# Altium project 2024001 A Soutra Plainsong Metronome.PrjPcb (part 3 of 3)

## Sheet IOa.SchDoc: Plainsong Metronome
size A4; SheetNumber: 8; SheetTotal: 9
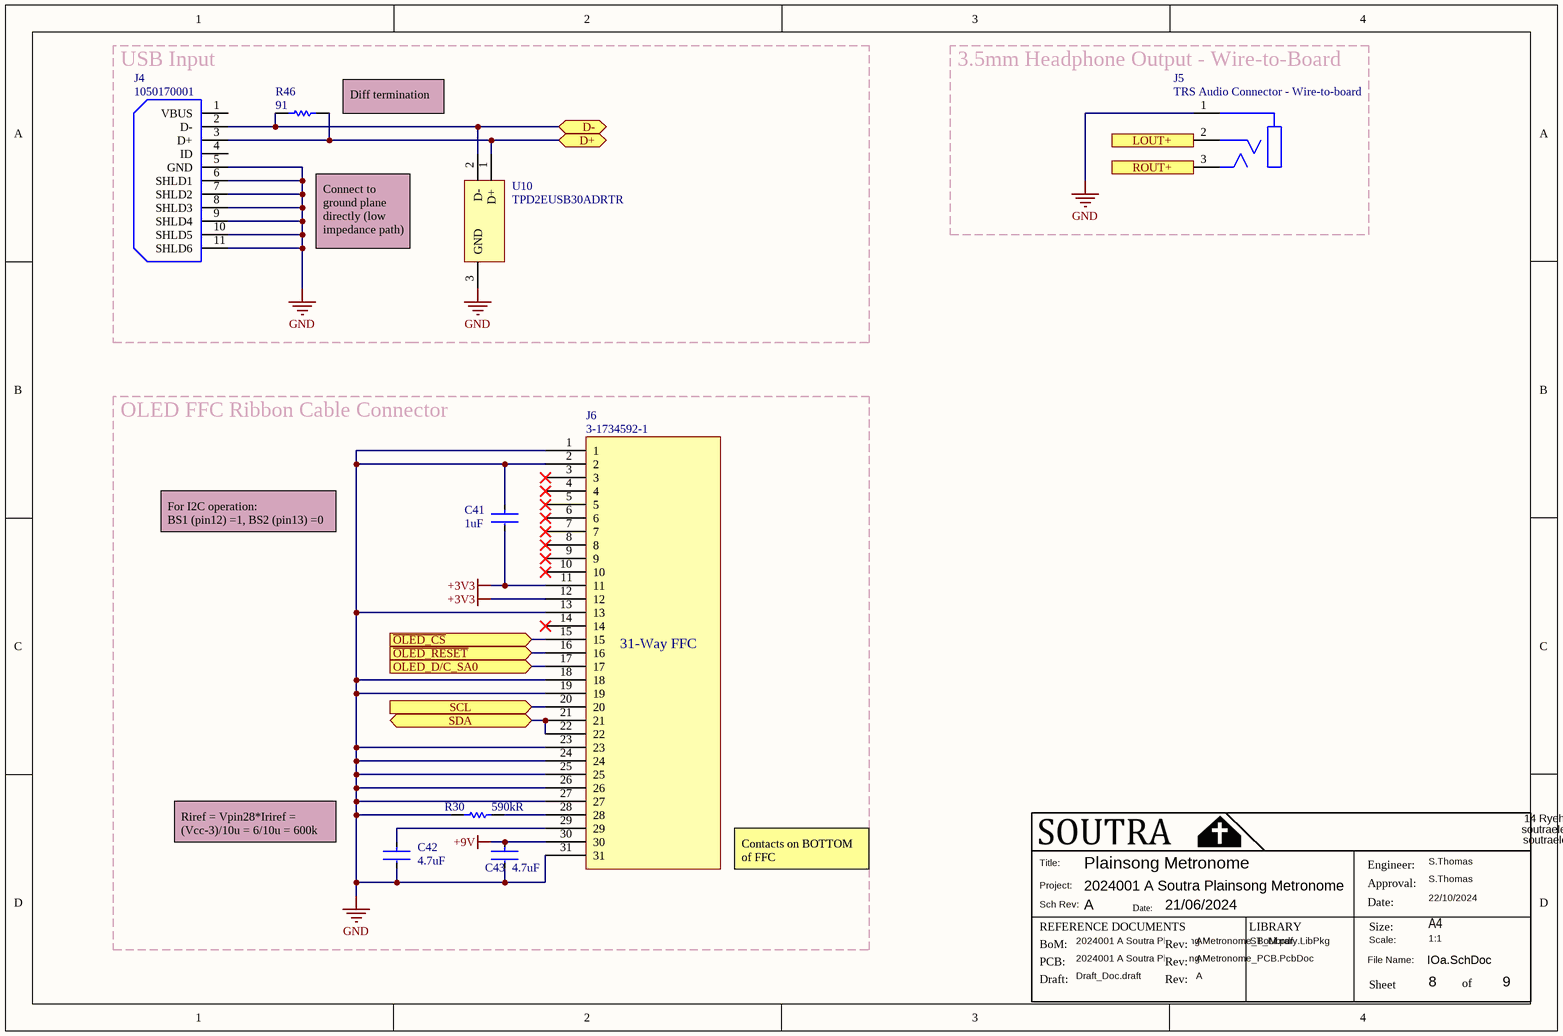
[diagram p7: IOa.SchDoc]

### Parts
C41  value 1uF  [CAPC1005X06L]  (hidden comment: CC0402KRX5R6BB105)
C42  value 4.7uF  [CC1206-IPC_A]  (hidden comment: CL31B475KAHNNNE)
C43  value 4.7uF  [CC1206-IPC_A]  (hidden comment: CL31B475KAHNNNE)
J4  1050170001  [1050170001_USB-MICRO-B_V]
J5  TRS Audio Connector - Wire-to-board  [J_GENERIC_PIN-HEADER_2.54_1X3]
J6  3-1734592-1  [AMP-TE_3-1734592-1]
R30  value 590kR  [RESC_0402_1005X40X25LL05T10]  (hidden comment: RC0402FR-07590KL)
R46  value 91  [RESC_0603_1608X06L]  (hidden comment: ERJ-PA3F91R0V)
U10  TPD2EUSB30ADRTR  [DRT0003A]

### Blocks framed on the sheet
USB Input: J4 R46 U10
3.5mm Headphone Output - Wire-to-Board: J5

### Ports
D+ (bidir, see Block Diagram[3C], MCU[1C]), D- (bidir, see Block Diagram[3C], MCU[1C]), LOUT+ (in, see Block Diagram[4C], Amplifiers[1B], CODEC[3B]), OLED_D/C_SA0 (in, see Block Diagram[3C], MCU[3C]), ROUT+ (in, see Block Diagram[4C], Amplifiers[3B], CODEC[3B]), SCL (in, see Block Diagram[3C], Amplifiers[1A], CODEC[2B], MCU[4B]), SDA (bidir, see Block Diagram[3C], Amplifiers[1A], CODEC[2B], MCU[4B]), ~{OLED_CS} (in, see Block Diagram[3C], MCU[3C]), ~{OLED_RESET} (in, see Block Diagram[3C], MCU[3C])

### Nets
+3V3: C41.2 J6.11 J6.12
+9V: C43.1 J6.30
GND: C41.1 C42.2 C43.2 J4.5(GND) J4.6(SHLD1) J4.7(SHLD2) J4.8(SHLD3) J4.9(SHLD4) J4.10(SHLD5) J4.11(SHLD6) J5.1 J6.1 J6.2 J6.13 J6.18 J6.19 J6.23 J6.24 J6.25 J6.26 J6.27 J6.31 R30.1 U10.3(GND)
~{OLED_CS}: J6.15 ; port ~{OLED_CS}
~{OLED_RESET}: J6.16 ; port ~{OLED_RESET}
D_N: J4.2(D-) R46.1 U10.2(D-) ; port D-
D_P: J4.3(D+) R46.2 U10.1(D+) ; port D+
LOUT+: J5.2 ; port LOUT+
OLED_D/C_SA0: J6.17 ; port OLED_D/C_SA0
ROUT+: J5.3 ; port ROUT+
SCL: J6.20 ; port SCL
SDA: J6.21 J6.22 ; port SDA
NetC42_1: C42.1 J6.29
NetJ6_28: J6.28 R30.2

Not connected (* = marked no-connect by the designer): J4 1(VBUS) 4(ID); J6 3* 4* 5* 6* 7* 8* 9* 10* 14*

### Notes on the sheet
- (near R46) Diff termination
- Connect to ground plane directly (low impedance path)
- OLED FFC Ribbon Cable Connector
- For I2C operation:
  BS1 (pin12) =1, BS2 (pin13) =0
- Riref = Vpin28*Iriref = (Vcc-3)/10u = 6/10u = 600k
- Contacts on BOTTOM of FFC
- Title:
- Project:
- Sch Rev:
- Date:
- Engineer:
- Approval:
- REFERENCE DOCUMENTS
- BoM:
- PCB:
- Draft:
- Rev:
- LIBRARY
- File Name:
- Scale:
- Size:
- Sheet
- A4
- of
- (in symbol 3-1734592-1) 31-Way FFC

### Library data of the parts
C41 = CC0402KRX5R6BB105: Ceramic Capacitor, Multilayer, Ceramic, 10V, 10% +Tol, 10% -Tol, X5R, 15% TC, 1uF, Surface Mount, 0402; Manufacturer: Yageo; Alternative Part: 0402ZD105KAT2A; Alternative Part Manufacturer: KYOCERA AVX; Multilayer: Yes; Supplier: Farnell; Supplier Part Number: 1458896; Manufacturer Part Number: CC0402KRX5R6BB105; RoHS: Yes; Category: Ceramic Capacitors; Stock: 12220000; Pricing: 10=0.039, 100=0.023; Mounting Technology: Surface Mount; Pins: 2; Dielectric Material: Ceramic; Package Shape: Rectangular; Case/Package: 0402; Terminal Finish: Nickel; Min Operating Temperature: -55°C; Max Operating Temperature: 85°C; JESD-609 Code: e3; Capacitor Type: Ceramic; Tolerance  (fill in as +-): 10%; Package Style: SMTMeter; Packaging: Tape and Reel; Tolerance (fill in as +-): 10%; Rated DC Voltage (URdc): 10V; Temperature Characteristics Code: X5R; Termination: Wraparound; Length: 1mm; Width: 0.5mm; Height: 0.5mm; Reach SVHC Compliant: Yes; RoHS Compliant: Yes; ComponentLink1URL: https://datasheet.ciiva.com:443/pdfs/VipMasterIC/IC/YAGO/YAGO-S-A0006851646/YAGO-S-A0006851646-1.pdf?src-supplier=IHS+Markit; ComponentLink1Description: https://datasheet.ciiva.com:443/pdfs/VipMasterIC/IC/YAGO/YAGO-S-A0006851646/YAGO-S-A0006851646-1.pdf?src-supplier=IHS+Markit; ComponentLink2URL: https://datasheet.ciiva.com/176/upy-gphc-x5r-4v-to-50v-12-176704.pdf?src-supplier=Digi-Key; ComponentLink2Description: https://datasheet.ciiva.com/176/upy-gphc-x5r-4v-to-50v-12-176704.pdf?src-supplier=Digi-Key; ComponentLink3URL: https://datasheet.ciiva.com/176/mlccorderingcode-176705.pdf?src-supplier=Digi-Key; ComponentLink3Description: https://datasheet.ciiva.com/176/mlccorderingcode-176705.pdf?src-supplier=Digi-Key; ComponentLink4URL: https://datasheet.ciiva.com/176/mlccorderingcode-176706.pdf?src-supplier=Digi-Key; ComponentLink4Description: https://datasheet.ciiva.com/176/mlccorderingcode-176706.pdf?src-supplier=Digi-Key; Supplier 1: Digikey; Supplier Part Number 1: 311-1439-1-ND; Pricing 1: 1=0.08, 10=0.058, 50=0.034, 100=0.027; Alternative Part Supplier: Farnell; Alternative Part Supplier Part Number: 1740588
C42 C43 = CL31B475KAHNNNE: Ceramic Capacitor, Multilayer, Ceramic, 25V, 10% +Tol, 10% -Tol, X7R, 15% TC, 4.7uF, Surface Mount, 1206; Manufacturer: Samsung; Multilayer: Yes; Supplier: Digikey; Supplier Part Number: 1276-1055-1-ND; Manufacturer Part Number: CL31B475KAHNNNE; RoHS: Yes; Category: Ceramic Capacitors; Stock: 245034; Pricing: 1=0.18, 10=0.116, 50=0.0732, 100=0.0585, 500=0.04228, 1000=0.0374 (USD); Mounting Technology: Surface Mount; Pins: 2; Dielectric Material: Ceramic; Package Shape: Rectangular; Case/Package: 1206; Terminal Finish: Nickel; Min Operating Temperature: -55°C; Max Operating Temperature: 125°C; JESD-609 Code: e3; Capacitor Type: Ceramic; Tolerance  (fill in as +-): 10%; Package Style: SMTMeter; Packaging: Tape and Reel; Tolerance (fill in as +-): 10%; Rated DC Voltage (URdc): 25V; Temperature Characteristics Code: X7R; Termination: Wraparound; Length: 3.2mm; Width: 1.6mm; Height: 1.8mm; Reach SVHC Compliant: Yes; RoHS Compliant: Yes; ComponentLink1URL: https://datasheet.ciiva.com:443/pdfs/VipMasterIC/IC/SEMS/SEMS-S-A0008522756/SEMS-S-A0008522493-1.pdf?src-supplier=IHS+Markit; ComponentLink1Description: https://datasheet.ciiva.com:443/pdfs/VipMasterIC/IC/SEMS/SEMS-S-A0008522756/SEMS-S-A0008522493-1.pdf?src-supplier=IHS+Markit; ComponentLink2URL: https://datasheet.ciiva.com/25728/cl31b475kahnnne-25728538.pdf?src-supplier=Digikey; ComponentLink2Description: https://datasheet.ciiva.com/25728/cl31b475kahnnne-25728538.pdf?src-supplier=Digikey; ComponentLink3URL: https://datasheet.ciiva.com/29200/452772-da-01-en-vs-kondensator-1206-29200897.pdf?src-supplier=Conrad; ComponentLink3Description: https://datasheet.ciiva.com/29200/452772-da-01-en-vs-kondensator-1206-29200897.pdf?src-supplier=Conrad; ComponentLink4URL: https://datasheet.ciiva.com/29200/452785-da-01-en-vs-kondensator-1206-29200901.pdf?src-supplier=Conrad; ComponentLink4Description: https://datasheet.ciiva.com/29200/452785-da-01-en-vs-kondensator-1206-29200901.pdf?src-supplier=Conrad; ComponentLink5URL: https://datasheet.ciiva.com/26310/mlcc-catalogdownload2013-eng-26310092.pdf?src-supplier=Distrelec; ComponentLink5Description: https://datasheet.ciiva.com/26310/mlcc-catalogdownload2013-eng-26310092.pdf?src-supplier=Distrelec; ComponentLink6URL: https://datasheet.ciiva.com/16428/cl10c1r5bb8nnnc-16428942.pdf?src-supplier=Future+Electronics; ComponentLink6Description: https://datasheet.ciiva.com/16428/cl10c1r5bb8nnnc-16428942.pdf?src-supplier=Future+Electronics; Supplier 1: Farnell; Supplier Part Number 1: 3013532; Pricing 1: 5=0.08, 50=0.05
J4 = 1050170001: Telecom and Datacom Connector, 5 Contact(s), Female, Right Angle, Surface Mount Terminal, Detent, Receptacle; Manufacturer Part Number: 105017-0001; Manufacturer: Molex; Supplier 1: Rs; Supplier Part Number 1: 8486764; Supplier: Farnell; Supplier Part Number: 3500663; Pricing: 1=0.97; Pricing 1: 5=0.754, 75=0.67
J5 = J_AUDIO_TRS
J6 = 3-1734592-1: FFC/FPC Connector, 31 Contact(s), 1 Row(s), Female, Right Angle, 0.02 inch Pitch, Surface Mount Terminal, Locking, Natural Insulator; Manufacturer: TE Connectivity; Connector Type: CARD EDGE CONNECTOR; Option: General Purpose; Number of Rows Loaded: 1; Number of Contacts: 31; Contact Pattern: RECTANGULAR; Contact Resistance: 35mR; Contact Style: BELLOWED TYPE; Insulation Resistance: 50MR; Rated Current (Signal): 500mA; Filter Feature: No; Dielectric Withstanding Voltage (AC): 250V; Durability: 15Cycles; Body Breadth: 0.079inch; Body Depth: 0.201inch; Body Length: 0.824inch; Reference Standard: UL; Reliability: COMMERCIAL; Supplier 1: Farnell; Supplier Part Number 1: 3398664; Manufacturer Part Number: 3-1734592-1; RoHS: Yes; Category: FFC / FPC; Stock 1: 10236; Pricing 1: 1=1.44, 10=1.26, 100=1.15; Mounting Technology: Board; Contact Finish - Mating: NOT SPECIFIED; Insulation Color: Natural; Insulation Material: Thermoplastic; Min Operating Temperature: -40°C; Max Operating Temperature: 85°C; Contact Gender: Female; Mounting Style: RIGHT ANGLE; Termination: SMD/SMT; Number Of PCB Rows: 1; PCB Contact Pattern: RECTANGULAR; Mixed Contacts: No; Manufacturer Series: 1734592; Mating Information: NO; Terminal Pitch: 0.5mm; Mating Contact Pitch: 0.02inch; Mounting Option 1: LOCKING; Flammability Rating: UL94 V-0; DIN Conformance: No; IEC Conformance: No; MIL Conformance: No; Reach SVHC Compliant: Yes; RoHS Compliant: Yes; ComponentLink1URL: https://www.te.com:443/usa-en/product-3-1734592-1.datasheet.pdf?src-supplier=IHS+Markit; ComponentLink1Description: https://www.te.com:443/usa-en/product-3-1734592-1.datasheet.pdf?src-supplier=IHS+Markit; ComponentLink2URL: https://datasheet.ciiva.com/10364/eng-ds-1-1773440-6-0506-10364463.pdf?src-supplier=Avnet; ComponentLink2Description: https://datasheet.ciiva.com/10364/eng-ds-1-1773440-6-0506-10364463.pdf?src-supplier=Avnet; ComponentLink3URL: https://datasheet.ciiva.com/8066/1650059-8066840.pdf?src-supplier=Element14; ComponentLink3Description: https://datasheet.ciiva.com/8066/1650059-8066840.pdf?src-supplier=Element14; ComponentLink4URL: https://datasheet.ciiva.com/49629/eng-ds-1-1773440-6-0506-49629301.pdf?src-supplier=Onlinecomponents.com; ComponentLink4Description: https://datasheet.ciiva.com/49629/eng-ds-1-1773440-6-0506-49629301.pdf?src-supplier=Onlinecomponents.com; ComponentLink5URL: https://datasheet.ciiva.com/671/eng-cd-1734592-c-c-1734592-671970.pdf?src-supplier=Digikey; ComponentLink5Description: https://datasheet.ciiva.com/671/eng-cd-1734592-c-c-1734592-671970.pdf?src-supplier=Digikey; ComponentLink6URL: https://datasheet.ciiva.com/671/eng-cd-1734592-c-c-1734592-671971.pdf?src-supplier=Digikey; ComponentLink6Description: https://datasheet.ciiva.com/671/eng-cd-1734592-c-c-1734592-671971.pdf?src-supplier=Digikey; ComponentLink7URL: https://datasheet.ciiva.com/671/eng-cd-1734592-c-c-1734592-671972.pdf?src-supplier=Digikey; ComponentLink7Description: https://datasheet.ciiva.com/671/eng-cd-1734592-c-c-1734592-671972.pdf?src-supplier=Digikey
R30 = RC0402FR-07590KL: Fixed Resistor, Metal Glaze/thick Film, 0.0625W, 590000ohm, 50V, 1% +/-Tol, 100ppm/Cel, Surface Mount, 0402; Manufacturer: Yageo; Alternative Part: CRCW0402590KFKED; Alternative Part Manufacturer: Vishay; Additional Feature: LASER TRIMMABLE; Power: 62.5mW; Rated Temperature: 70°C; Temperature Coefficient: 100ppm/°C; Package Height: 0.35mm; Package Length: 1mm; Package Width: 0.5mm; Supplier 1: Farnell; Supplier Part Number 1: 3951243; Manufacturer Part Number: RC0402FR-07590KL; RoHS: Yes; Category: Chip SMD Resistors; Stock 1: 37168; Pricing 1: 10=0.0096, 100=0.0055; Mounting Technology: Surface Mount; Pins: 2; Package Shape: Rectangular; Case/Package: 0402; Terminal Finish: Nickel; Min Operating Temperature: -55°C; Max Operating Temperature: 155°C; Tolerance: 1%; JESD-609 Code: e3; Resistor Type: FIXED RESISTOR; Construction: Chip; Package Style: SMTMeter; Packaging: Tape and Reel; Technology: METAL GLAZE/THICK FILM; Termination: Wraparound; Working Voltage: 50V; Reach SVHC Compliant: Yes; RoHS Compliant: Yes; ComponentLink1URL: https://datasheet.ciiva.com:443/pdfs/VipMasterIC/IC/YAGO/YAGO-S-A0008145938/YAGO-S-A0008145938-1.pdf?src-supplier=IHS+Markit; ComponentLink1Description: https://datasheet.ciiva.com:443/pdfs/VipMasterIC/IC/YAGO/YAGO-S-A0008145938/YAGO-S-A0008145938-1.pdf?src-supplier=IHS+Markit; ComponentLink2URL: https://datasheet.ciiva.com/8885/pyu-rc0402-51-rohs-l-6-8885212.pdf?src-supplier=Avnet; ComponentLink2Description: https://datasheet.ciiva.com/8885/pyu-rc0402-51-rohs-l-6-8885212.pdf?src-supplier=Avnet; ComponentLink3URL: https://datasheet.ciiva.com/17419/pyu-rc0402-51-rohs-l-6-r-17419533.pdf?src-supplier=Future+Electronics; ComponentLink3Description: https://datasheet.ciiva.com/17419/pyu-rc0402-51-rohs-l-6-r-17419533.pdf?src-supplier=Future+Electronics; Supplier 2: Digikey; Supplier Part Number 2: 311-59KLRCT-ND; Stock 2: 999878; Pricing 2: 1=0.08, 10=0.012, 50=0.007, 100=0.0058; Alternative Part Supplier: Farnell; Alternative Part Supplier Part Number: 2141013
R46 = ERJ-PA3F91R0V: Res Thick Film 0603 91 Ohm 1% 0.25W(1/4W) ±100ppm/C Pad SMD Automotive T/R; Manufacturer: Panasonic; Supplier: Farnell; Supplier Part Number: 2335962; Manufacturer Part Number: ERJ-PA3F91R0V; RoHS: Yes; Category: Chip SMD Resistors; Stock: 5736; Pricing: 10=0.05, 100=0.03; ComponentLink1URL: https://datasheet.ciiva.com/49048/1801181-49048216.pdf?src-supplier=Element14; ComponentLink1Description: https://datasheet.ciiva.com/49048/1801181-49048216.pdf?src-supplier=Element14
U10 = TPD2EUSB30ADRTR: ESD / Surge Solution for High Speed, Low Voltage Interface, 2 Channels, -40 to +85 degC, 3-pin SOT (DRT), Green (RoHS & no Sb/Br); Manufacturer: Texas Instruments; IEC 61000-4-2 Air-Gap(+/- kV): 8; SubFamily: ESD Solution; 1394 / Firewire: TRUE; IO Leakage Current(nA): 10; Differential Capacitance(pF): 0.05; Breakdown Voltage(Min)(V): 4.5; IO Capacitance(Typ)(pF): 0.7; Mounting Technology: Surface Mount; PartNumber: TPD2EUSB30ADRTR; ComponentLink2URL: SamplesURL:http://www.ti.com/product/tpd2eusb30a#samples; IEC 61000-4-2 Contact(+/- kV): 8; PackageReference: DRT0003A; Eco-Plan: Green (RoHS & no Sb/Br); ComponentLink2Description: URL Link1; USB Full Speed: TRUE; USB High Speed: TRUE; PackageDescription: 3-Flat Lead Plastic Small Outline, 1 x 1 mm (inc leads), 0.35 mm Pitch; Serial ATA / eSATA: TRUE; ComponentLink1URL: http://www.ti.com/general/docs/lit/getliterature.tsp?genericPartNumber=TPD2EUSB30A&fileType=pdf; DatasheetVersion: SLVSAC2C; PackageVersion: revD, Jun-2008; ComponentLink1Description: Datasheet; HDMI: TRUE; USB Super Speed: TRUE; Supplier 1: Farnell; Supplier Part Number 1: 3116501; Pricing 1: 5=0.53, 10=0.4, 100=0.22; Stock 1: 5225; Manufacturer Part Number: TPD2EUSB30ADRTR

## Sheet IOb.SchDoc: Plainsong Metronome
size A4; SheetNumber: 9; SheetTotal: 9
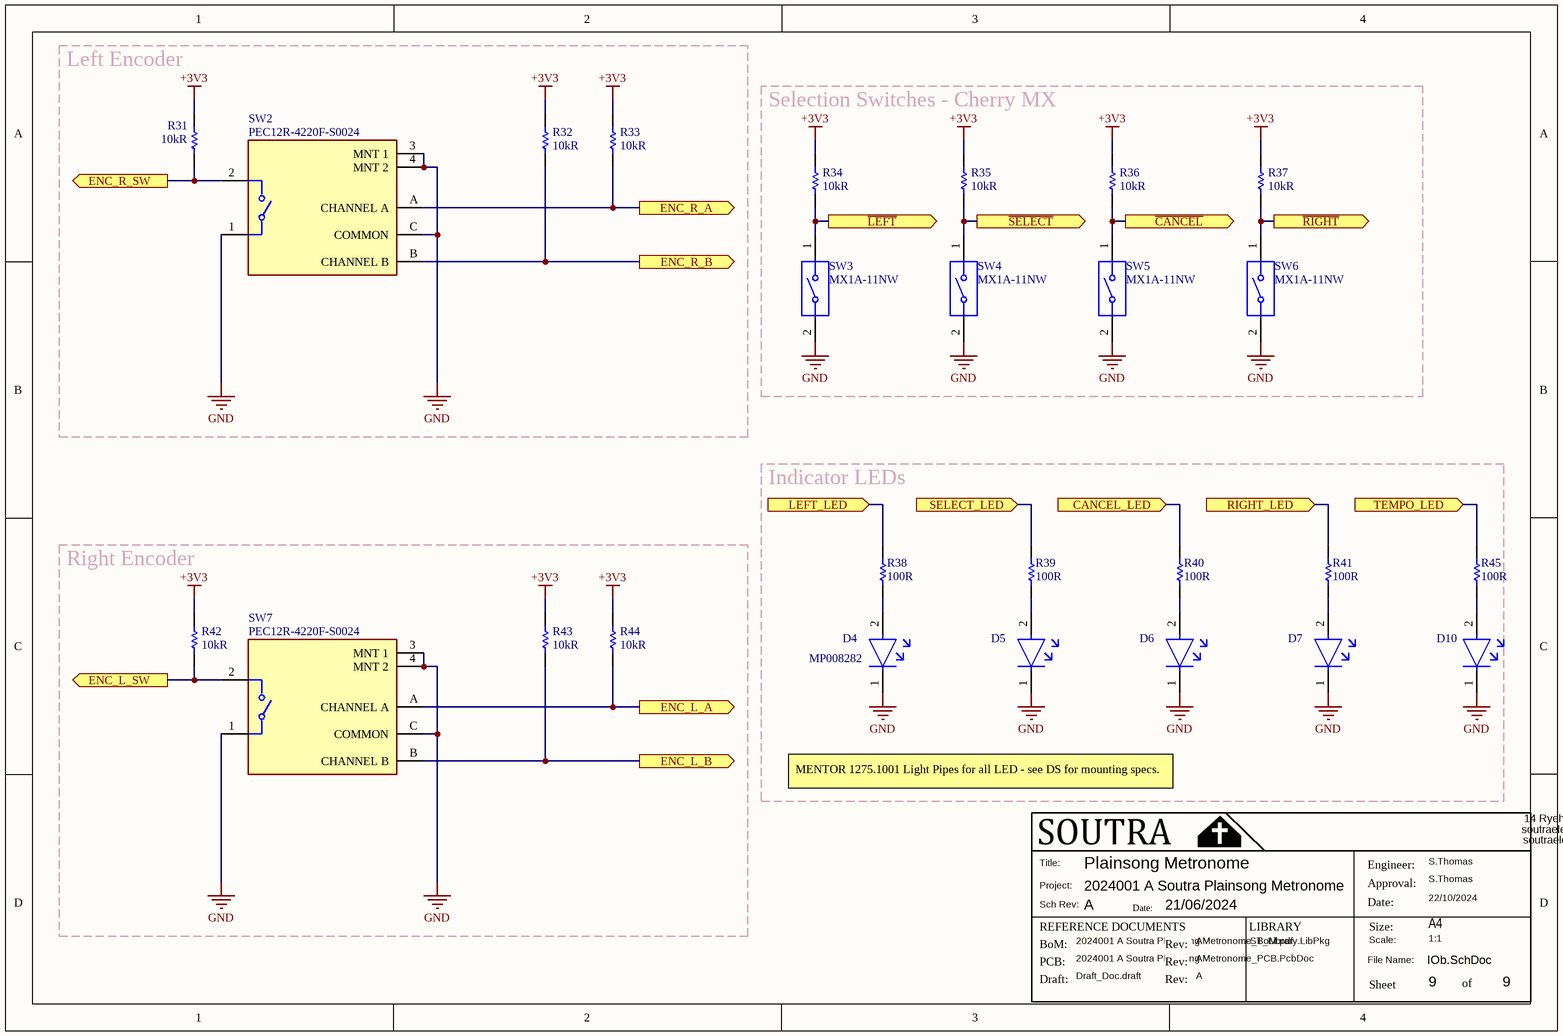
[diagram p8: IOb.SchDoc]

### Parts
D4  MP008282  [DIOC_0603_1706X06L]
D5  MP008282  [DIOC_0603_1706X06L]  (value not drawn)
D6  MP008282  [DIOC_0603_1706X06L]  (value not drawn)
D7  MP008282  [DIOC_0603_1706X06L]  (value not drawn)
D10  MP008282  [DIOC_0603_1706X06L]  (value not drawn)
R31  value 10kR  [RESC_0805_2013X50X30LL20T20]  (hidden comment: RC0805JR-0710KL)
R32  value 10kR  [RESC_0805_2013X50X30LL20T20]  (hidden comment: RC0805JR-0710KL)
R33  value 10kR  [RESC_0805_2013X50X30LL20T20]  (hidden comment: RC0805JR-0710KL)
R34  value 10kR  [RESC_0805_2013X50X30LL20T20]  (hidden comment: RC0805JR-0710KL)
R35  value 10kR  [RESC_0805_2013X50X30LL20T20]  (hidden comment: RC0805JR-0710KL)
R36  value 10kR  [RESC_0805_2013X50X30LL20T20]  (hidden comment: RC0805JR-0710KL)
R37  value 10kR  [RESC_0805_2013X50X30LL20T20]  (hidden comment: RC0805JR-0710KL)
R38  value 100R  [RESC_0805_2013X50X30LL20T20]  (hidden comment: CRCW0805100RFKTA)
R39  value 100R  [RESC_0805_2013X50X30LL20T20]  (hidden comment: CRCW0805100RFKTA)
R40  value 100R  [RESC_0805_2013X50X30LL20T20]  (hidden comment: CRCW0805100RFKTA)
R41  value 100R  [RESC_0805_2013X50X30LL20T20]  (hidden comment: CRCW0805100RFKTA)
R42  value 10kR  [RESC_0805_2013X50X30LL20T20]  (hidden comment: RC0805JR-0710KL)
R43  value 10kR  [RESC_0805_2013X50X30LL20T20]  (hidden comment: RC0805JR-0710KL)
R44  value 10kR  [RESC_0805_2013X50X30LL20T20]  (hidden comment: RC0805JR-0710KL)
R45  value 100R  [RESC_0805_2013X50X30LL20T20]  (hidden comment: CRCW0805100RFKTA)
SW2  PEC12R-4220F-S0024  [BOURNS_PEC12R-4220F-S0024]
SW3  MX1A-11NW  [CHERRY_MX1A-11NW]
SW4  MX1A-11NW  [CHERRY_MX1A-11NW]
SW5  MX1A-11NW  [CHERRY_MX1A-11NW]
SW6  MX1A-11NW  [CHERRY_MX1A-11NW]
SW7  PEC12R-4220F-S0024  [BOURNS_PEC12R-4220F-S0024]

### Blocks framed on the sheet
Left Encoder: R31-R33 SW2
Selection Switches - Cherry MX: R34-R37 SW3-SW6
Indicator LEDs: D4-D7 D10 R38-R41 R45
Right Encoder: R42-R44 SW7

### Ports
CANCEL_LED (in, see Block Diagram[2C], MCU[3B]), ENC_L_A (out, see Block Diagram[2C], MCU[2B]), ENC_L_B (out, see Block Diagram[2C], MCU[2B]), ENC_L_SW (out, see Block Diagram[2C], MCU[2B]), ENC_R_A (out, see Block Diagram[2C], MCU[3B]), ENC_R_B (out, see Block Diagram[2C], MCU[2B]), ENC_R_SW (out, see Block Diagram[2C], MCU[3B]), LEFT_LED (in, see Block Diagram[2C], MCU[2C]), RIGHT_LED (in, see Block Diagram[2C], MCU[2B]), SELECT_LED (in, see Block Diagram[2C], MCU[2C]), TEMPO_LED (in, see Block Diagram[2B], MCU[2C]), ~{CANCEL} (out, see Block Diagram[2C], MCU[3B]), ~{LEFT} (out, see Block Diagram[2B], MCU[3B]), ~{RIGHT} (out, see Block Diagram[2C], MCU[3B]), ~{SELECT} (out, see Block Diagram[2B], MCU[3B])

### Nets
+3V3: R31.2 R32.2 R33.2 R34.2 R35.2 R36.2 R37.2 R42.2 R43.2 R44.2
GND: D4.1(C) D5.1(C) D6.1(C) D7.1(C) D10.1(C) SW2.1 SW2.3(MNT_1) SW2.4(MNT_2) SW2.C(COMMON) SW3.2 SW4.2 SW5.2 SW6.2 SW7.1 SW7.3(MNT_1) SW7.4(MNT_2) SW7.C(COMMON)
CANCEL_LED: R40.1 ; port CANCEL_LED
NetD4_2: D4.2(A) R38.2
NetD5_2: D5.2(A) R39.2
NetD6_2: D6.2(A) R40.2
NetD7_2: D7.2(A) R41.2
NetD10_2: D10.2(A) R45.2
NetR31_1: R31.1 SW2.2 ; port ENC_R_SW
NetR32_1: R32.1 SW2.B(CHANNEL_B) ; port ENC_R_B
NetR33_1: R33.1 SW2.A(CHANNEL_A) ; port ENC_R_A
NetR34_1: R34.1 SW3.1 ; port ~{LEFT}
NetR35_1: R35.1 SW4.1 ; port ~{SELECT}
NetR36_1: R36.1 SW5.1 ; port ~{CANCEL}
NetR37_1: R37.1 SW6.1 ; port ~{RIGHT}
NetR38_1: R38.1 ; port LEFT_LED
NetR39_1: R39.1 ; port SELECT_LED
NetR41_1: R41.1 ; port RIGHT_LED
NetR42_1: R42.1 SW7.2 ; port ENC_L_SW
NetR43_1: R43.1 SW7.B(CHANNEL_B) ; port ENC_L_B
NetR44_1: R44.1 SW7.A(CHANNEL_A) ; port ENC_L_A
NetR45_1: R45.1 ; port TEMPO_LED

### Notes on the sheet
- MENTOR 1275.1001 Light Pipes for all LED - see DS for mounting specs.
- Title:
- Project:
- Sch Rev:
- Date:
- Engineer:
- Approval:
- REFERENCE DOCUMENTS
- BoM:
- PCB:
- Draft:
- Rev:
- LIBRARY
- File Name:
- Scale:
- Size:
- Sheet
- A4
- of

### Library data of the parts
D4-D7 D10 = MP008282: Led, Green, 70Mcd, 575Nm, 0603 Rohs Compliant: Yes; Manufacturer: Multicomp; Alternative Part: LG Q396-PS-35; Alternative Part Manufacturer: AMS OSRAM GROUP; Supplier: Farnell; Supplier Part Number: 3796313; Manufacturer Part Number: MP008282; RoHS: No; Category: Uncategorized; Stock: 8324; Pricing: 5=0.0713, 10=0.0611, 100=0.0476; Alternative Part Supplier: Farnell; Alternative Part Supplier Part Number: 2575345
R31-R37 R42-R44 = RC0805JR-0710KL: Fixed Resistor, Metal Glaze/thick Film, 0.125W, 10000ohm, 150V, 5% +/-Tol, 100ppm/Cel, Surface Mount, 0805; Manufacturer: Yageo; Alternative Part: MCMR08X103 JTL; Additional Feature: LASER TRIMMABLE; Power: 125mW; Rated Temperature: 70°C; Temperature Coefficient: 100ppm/°C; Package Height: 0.5mm; Package Length: 2mm; Package Width: 1.25mm; Supplier: Farnell; Supplier Part Number: 9234136; Manufacturer Part Number: RC0805JR-0710KL; RoHS: Yes; Category: Chip SMD Resistors; Stock: 893694; Pricing: 10=0.013, 100=0.007, 500=0.006; Mounting Technology: Surface Mount; Pins: 2; Package Shape: Rectangular; Case/Package: 0805; Terminal Finish: Nickel; Min Operating Temperature: -55°C; Max Operating Temperature: 155°C; Tolerance: 5%; JESD-609 Code: e3; Resistor Type: FIXED RESISTOR; Construction: Chip; Package Style: SMTMeter; Packaging: Tape and Reel; Technology: METAL GLAZE/THICK FILM; Termination: Wraparound; Working Voltage: 150V; Reach SVHC Compliant: Yes; RoHS Compliant: Yes; ComponentLink1URL: https://datasheet.ciiva.com:443/pdfs/VipMasterIC/IC/YAGO/YAGO-S-A0008145938/YAGO-S-A0008145938-1.pdf?src-supplier=IHS+Markit; ComponentLink1Description: https://datasheet.ciiva.com:443/pdfs/VipMasterIC/IC/YAGO/YAGO-S-A0008145938/YAGO-S-A0008145938-1.pdf?src-supplier=IHS+Markit; ComponentLink2URL: https://datasheet.ciiva.com/7983/444164-7983765.pdf?src-supplier=Element14; ComponentLink2Description: https://datasheet.ciiva.com/7983/444164-7983765.pdf?src-supplier=Element14; ComponentLink3URL: https://datasheet.ciiva.com/7941/444164-7941870.pdf?src-supplier=Element14; ComponentLink3Description: https://datasheet.ciiva.com/7941/444164-7941870.pdf?src-supplier=Element14; ComponentLink4URL: https://datasheet.ciiva.com/7941/444164-7941871.pdf?src-supplier=Element14; ComponentLink4Description: https://datasheet.ciiva.com/7941/444164-7941871.pdf?src-supplier=Element14; Supplier 1: Digikey; Supplier Part Number 1: 311-10KARCT-ND; Pricing 1: 1=0.08, 10=0.018, 50=0.011, 100=0.009; Alternative Part Supplier: Farnell; Alternative Part Supplier Part Number: 2073612
R38-R41 R45 = CRCW0805100RFKTA: Fixed Resistor, Metal Glaze/thick Film, 0.125W, 100ohm, 150V, 1% +/-Tol, 100ppm/Cel, Surface Mount, 0805; Manufacturer: Vishay Dale; Alternative Part: CRCW0805100RFKEA; Alternative Part Manufacturer: VISHAY; Power: 125mW; Rated Temperature: 70°C; Temperature Coefficient: 100ppm/°C; Package Height: 0.45mm; Package Length: 2mm; Package Width: 1.25mm; Reference Standard: AEC-Q200; Supplier: Farnell; Supplier Part Number: 1652906; Manufacturer Part Number: CRCW0805100RFKTA; RoHS: No; Category: Chip SMD Resistors; Stock: 46002; Pricing: 10=0.06, 100=0.026; Mounting Technology: Surface Mount; Pins: 2; Package Shape: Rectangular; Case/Package: 0805; Terminal Finish: Nickel; Min Operating Temperature: -55°C; Max Operating Temperature: 155°C; Tolerance: 1%; JESD-609 Code: e0; Resistor Type: FIXED RESISTOR; Packaging: Tape and Reel; Technology: METAL GLAZE/THICK FILM; Termination: Wraparound; Working Voltage: 150V; Construction: Chip; Package Style: SMTMeter; RoHS Compliant: No; Reach SVHC Compliant: No; ComponentLink1URL: https://datasheet.ciiva.com:443/pdfs/VipMasterIC/IC/VISH/VISH-S-A0002183699/VISH-S-A0002183699-1.pdf?src-supplier=IHS+Markit; ComponentLink1Description: https://datasheet.ciiva.com:443/pdfs/VipMasterIC/IC/VISH/VISH-S-A0002183699/VISH-S-A0002183699-1.pdf?src-supplier=IHS+Markit; ComponentLink2URL: https://datasheet.ciiva.com/48525/dcrcw-48525548.pdf?src-supplier=Avnet; ComponentLink2Description: https://datasheet.ciiva.com/48525/dcrcw-48525548.pdf?src-supplier=Avnet; ComponentLink3URL: https://datasheet.ciiva.com/3258/dcrcw-3258014.pdf?src-supplier=Avnet; ComponentLink3Description: https://datasheet.ciiva.com/3258/dcrcw-3258014.pdf?src-supplier=Avnet; ComponentLink4URL: https://datasheet.ciiva.com/2567/dcrcw-2567005.pdf?src-supplier=Digi-Key; ComponentLink4Description: https://datasheet.ciiva.com/2567/dcrcw-2567005.pdf?src-supplier=Digi-Key; ComponentLink5URL: https://datasheet.ciiva.com/22673/1533075-22673125.pdf?src-supplier=Element14; ComponentLink5Description: https://datasheet.ciiva.com/22673/1533075-22673125.pdf?src-supplier=Element14; ComponentLink6URL: https://datasheet.ciiva.com/16498/dcrcw-16498296.pdf?src-supplier=Future+Electronics; ComponentLink6Description: https://datasheet.ciiva.com/16498/dcrcw-16498296.pdf?src-supplier=Future+Electronics; Supplier 1: Mouser; Supplier Part Number 1: 71-CRCW0805-100; Pricing 1: 1=0.12, 10=0.042, 100=0.027; Alternative Part Supplier: Farnell; Alternative Part Supplier Part Number: 1469862
SW2 SW7 = PEC12R-4220F-S0024: Rotary Position Encoder, Single, 2 Channels; Manufacturer: Bourns; Channels: 1; Supplier: Farnell; Supplier Part Number: 2663532; Manufacturer Part Number: PEC12R-4220F-S0024; RoHS: Yes; Category: Encoders; Stock: 3003; Pricing: 1=1.7, 5=1.49, 10=1.26, 20=1.16, 40=1.06, 75=0.97; Min Operating Temperature: -30°C; Max Operating Temperature: 70°C; Optoelectronic Device Type: ROTARY POSITION ENCODER; RoHS Compliant: Yes; Reach SVHC Compliant: Yes; ComponentLink1URL: https://datasheet.ciiva.com:443/pdfs/VipMasterIC/IC/BOUR/BOUR-S-A0008996893/BOUR-S-A0008996893-1.pdf?src-supplier=IHS+Markit; ComponentLink1Description: https://datasheet.ciiva.com:443/pdfs/VipMasterIC/IC/BOUR/BOUR-S-A0008996893/BOUR-S-A0008996893-1.pdf?src-supplier=IHS+Markit; ComponentLink2URL: https://datasheet.ciiva.com/29349/pec12r-29349497.pdf?src-supplier=Digikey; ComponentLink2Description: https://datasheet.ciiva.com/29349/pec12r-29349497.pdf?src-supplier=Digikey; Supplier 1: Digikey; Supplier Part Number 1: PEC12R-4220F-S0024-ND; Pricing 1: 1=1.28, 5=1.21, 10=1.14, 25=1.04, 75=0.97; Stock 1: 677
SW3-SW6 = MX1A-11NW: Keypad Switch, 1 Switches, SPST, Momentary, 0.01A, 12VDC, 0.78N, Solder Terminal, Through Hole-straight; Manufacturer: Cherry; Manufacturer Series: MX; Circuit Configuration: 1X1; Contact Bounce Time-Max: 5ms; Contact Current(DC)-Max: 10mA; Contact DC Max Rating R Load: .01A@12VDC; Contact Voltage(DC)-Max: 12V; Electrical Life: 50000000Cycles; Number of Switches: 1; Body Breadth: 15.6inch; Body Height: 11.6mm; Body Length or Diameter: 15.6mm; Supplier: Mech Boards; Supplier Part Number: ACHERSW0315325; Manufacturer Part Number: MX1A-11NW; RoHS: Yes; Category: Pushbutton Switches; Pricing: 10=5; Mounting Technology: Through Hole; Min Operating Temperature: -10°C; Max Operating Temperature: 70°C; Operating Force-Max: 0.78N; Switch Action: MOMENTARY; Switch Function: SPST; Switch Type: Keypad; Termination: Solder; Reach SVHC Compliant: Yes; RoHS Compliant: Yes; ComponentLink1URL: https://datasheet.ciiva.com:443/pdfs/VipMasterIC/IC/CHCP/CHCP-S-A0000003074/CHCP-S-A0000003074-1.pdf?src-supplier=IHS+Markit; ComponentLink1Description: https://datasheet.ciiva.com:443/pdfs/VipMasterIC/IC/CHCP/CHCP-S-A0000003074/CHCP-S-A0000003074-1.pdf?src-supplier=IHS+Markit; ComponentLink2URL: https://datasheet.ciiva.com/19475/513412-19475559.pdf?src-supplier=Jameco; ComponentLink2Description: https://datasheet.ciiva.com/19475/513412-19475559.pdf?src-supplier=Jameco; ComponentLink3URL: https://datasheet.ciiva.com/29188/706333-da-01-de-tastenmodul-mx1a-11nw-0-01a-12v-29188128.pdf?src-supplier=Conrad; ComponentLink3Description: https://datasheet.ciiva.com/29188/706333-da-01-de-tastenmodul-mx1a-11nw-0-01a-12v-29188128.pdf?src-supplier=Conrad; ComponentLink4URL: https://datasheet.ciiva.com/2869/mxseries-2869564.pdf?src-supplier=Digikey; ComponentLink4Description: https://datasheet.ciiva.com/2869/mxseries-2869564.pdf?src-supplier=Digikey; ComponentLink5URL: https://datasheet.ciiva.com/22638/1825426-22638522.pdf?src-supplier=Element14; ComponentLink5Description: https://datasheet.ciiva.com/22638/1825426-22638522.pdf?src-supplier=Element14; ComponentLink6URL: https://datasheet.ciiva.com/1701/1825426-1701391.pdf?src-supplier=Newark; ComponentLink6Description: https://datasheet.ciiva.com/1701/1825426-1701391.pdf?src-supplier=Newark; ComponentLink7URL: https://datasheet.ciiva.com/30215/cherry-mx-series-key-switch-30215301.pdf?src-supplier=Onlinecomponents.com; ComponentLink7Description: https://datasheet.ciiva.com/30215/cherry-mx-series-key-switch-30215301.pdf?src-supplier=Onlinecomponents.com; ComponentLink8URL: https://datasheet.ciiva.com/14536/70207618-14536679.pdf?src-supplier=Allied+Electronics; ComponentLink8Description: https://datasheet.ciiva.com/14536/70207618-14536679.pdf?src-supplier=Allied+Electronics

## Nets that join several sheets
+1V8: Power (C8.1 TP4.1 VREG3.1), CODEC (7 pins)
+3V3: Power (C6.1 TP3.1 VREG2.2 VREG2.4), CODEC (C25.1 R5.2 X2.4), MCU (23 pins), IOa (C41.2 J6.11 J6.12), IOb (10 pins)
+5V: Power (C2.1 TP2.1 VREG1.2), Amplifiers (14 pins)
+9V: Power (11 pins), IOa (C43.1 J6.30)
GND: Power (15 pins), CODEC (14 pins), MCU (24 pins), Amplifiers (24 pins), IOa (24 pins), IOb (17 pins)
~{AMP_SHDN}: MCU (U1.38), Amplifiers (TP31.1 U6.1 U7.1)
~{CODEC_IRQ}: CODEC (R6.1 U3.4), MCU (TP11.1 U1.46)
~{OLED_CS}: MCU (TP17.1 U1.4), IOa (J6.15)
~{OLED_RESET}: MCU (TP18.1 U1.3), IOa (J6.16)
CANCEL_LED: MCU (TP32.1 U1.26), IOb (R40.1)
D_N: MCU (U1.32), IOa (J4.2 R46.1 U10.2)
D_P: MCU (U1.33), IOa (J4.3 R46.2 U10.1)
I2S_CK: CODEC (U3.30), MCU (TP12.1 U1.21)
I2S_EXT_SD: CODEC (U3.27), MCU (TP14.1 U1.27)
I2S_SD: CODEC (U3.28), MCU (TP15.1 U1.28)
I2S_WS: CODEC (U3.29), MCU (TP13.1 U1.25)
LOUT+: CODEC (TP25.1 U3.22), Amplifiers (C34.1), IOa (J5.2)
LOUT-: CODEC (TP27.1 U3.21), Amplifiers (C36.1)
MCLK_EN: CODEC (R5.1 X2.1), MCU (TP10.1 U1.41)
NetR31_1: MCU (U1.39), IOb (R31.1 SW2.2)
NetR32_1: MCU (U1.10), IOb (R32.1 SW2.B)
NetR33_1: MCU (U1.40), IOb (R33.1 SW2.A)
NetR34_1: MCU (U1.18), IOb (R34.1 SW3.1)
NetR35_1: MCU (U1.20), IOb (R35.1 SW4.1)
NetR36_1: MCU (U1.45), IOb (R36.1 SW5.1)
NetR37_1: MCU (U1.19), IOb (R37.1 SW6.1)
NetR38_1: MCU (U1.30), IOb (R38.1)
NetR39_1: MCU (U1.34), IOb (R39.1)
NetR41_1: MCU (U1.29), IOb (R41.1)
NetR42_1: MCU (U1.12), IOb (R42.1 SW7.2)
NetR43_1: MCU (U1.13), IOb (R43.1 SW7.B)
NetR44_1: MCU (U1.11), IOb (R44.1 SW7.A)
NetR45_1: MCU (U1.37), IOb (R45.1)
OLED_D/C_SA0: MCU (TP20.1 U1.2), IOa (J6.17)
ROUT+: CODEC (TP29.1 U3.19), Amplifiers (C33.1), IOa (J5.3)
ROUT-: CODEC (TP30.1 U3.20), Amplifiers (C35.1)
SCL: CODEC (U3.2), MCU (R2.1 TP8.1 U1.42), Amplifiers (U4.2 U5.2 U8.2 U9.2), IOa (J6.20)
SDA: CODEC (U3.3), MCU (R3.1 TP7.1 U1.43), Amplifiers (U4.3 U5.3 U8.3 U9.3), IOa (J6.21 J6.22)

## Assembly variants
2024001 A Soutra Plainsong Metronome - DNF: not fitted R8 R9